# Altium schematic sheet DCI_MCU_144.SchDoc
size 420 x 297 mm; Project: NUCLEO-XXXXZX
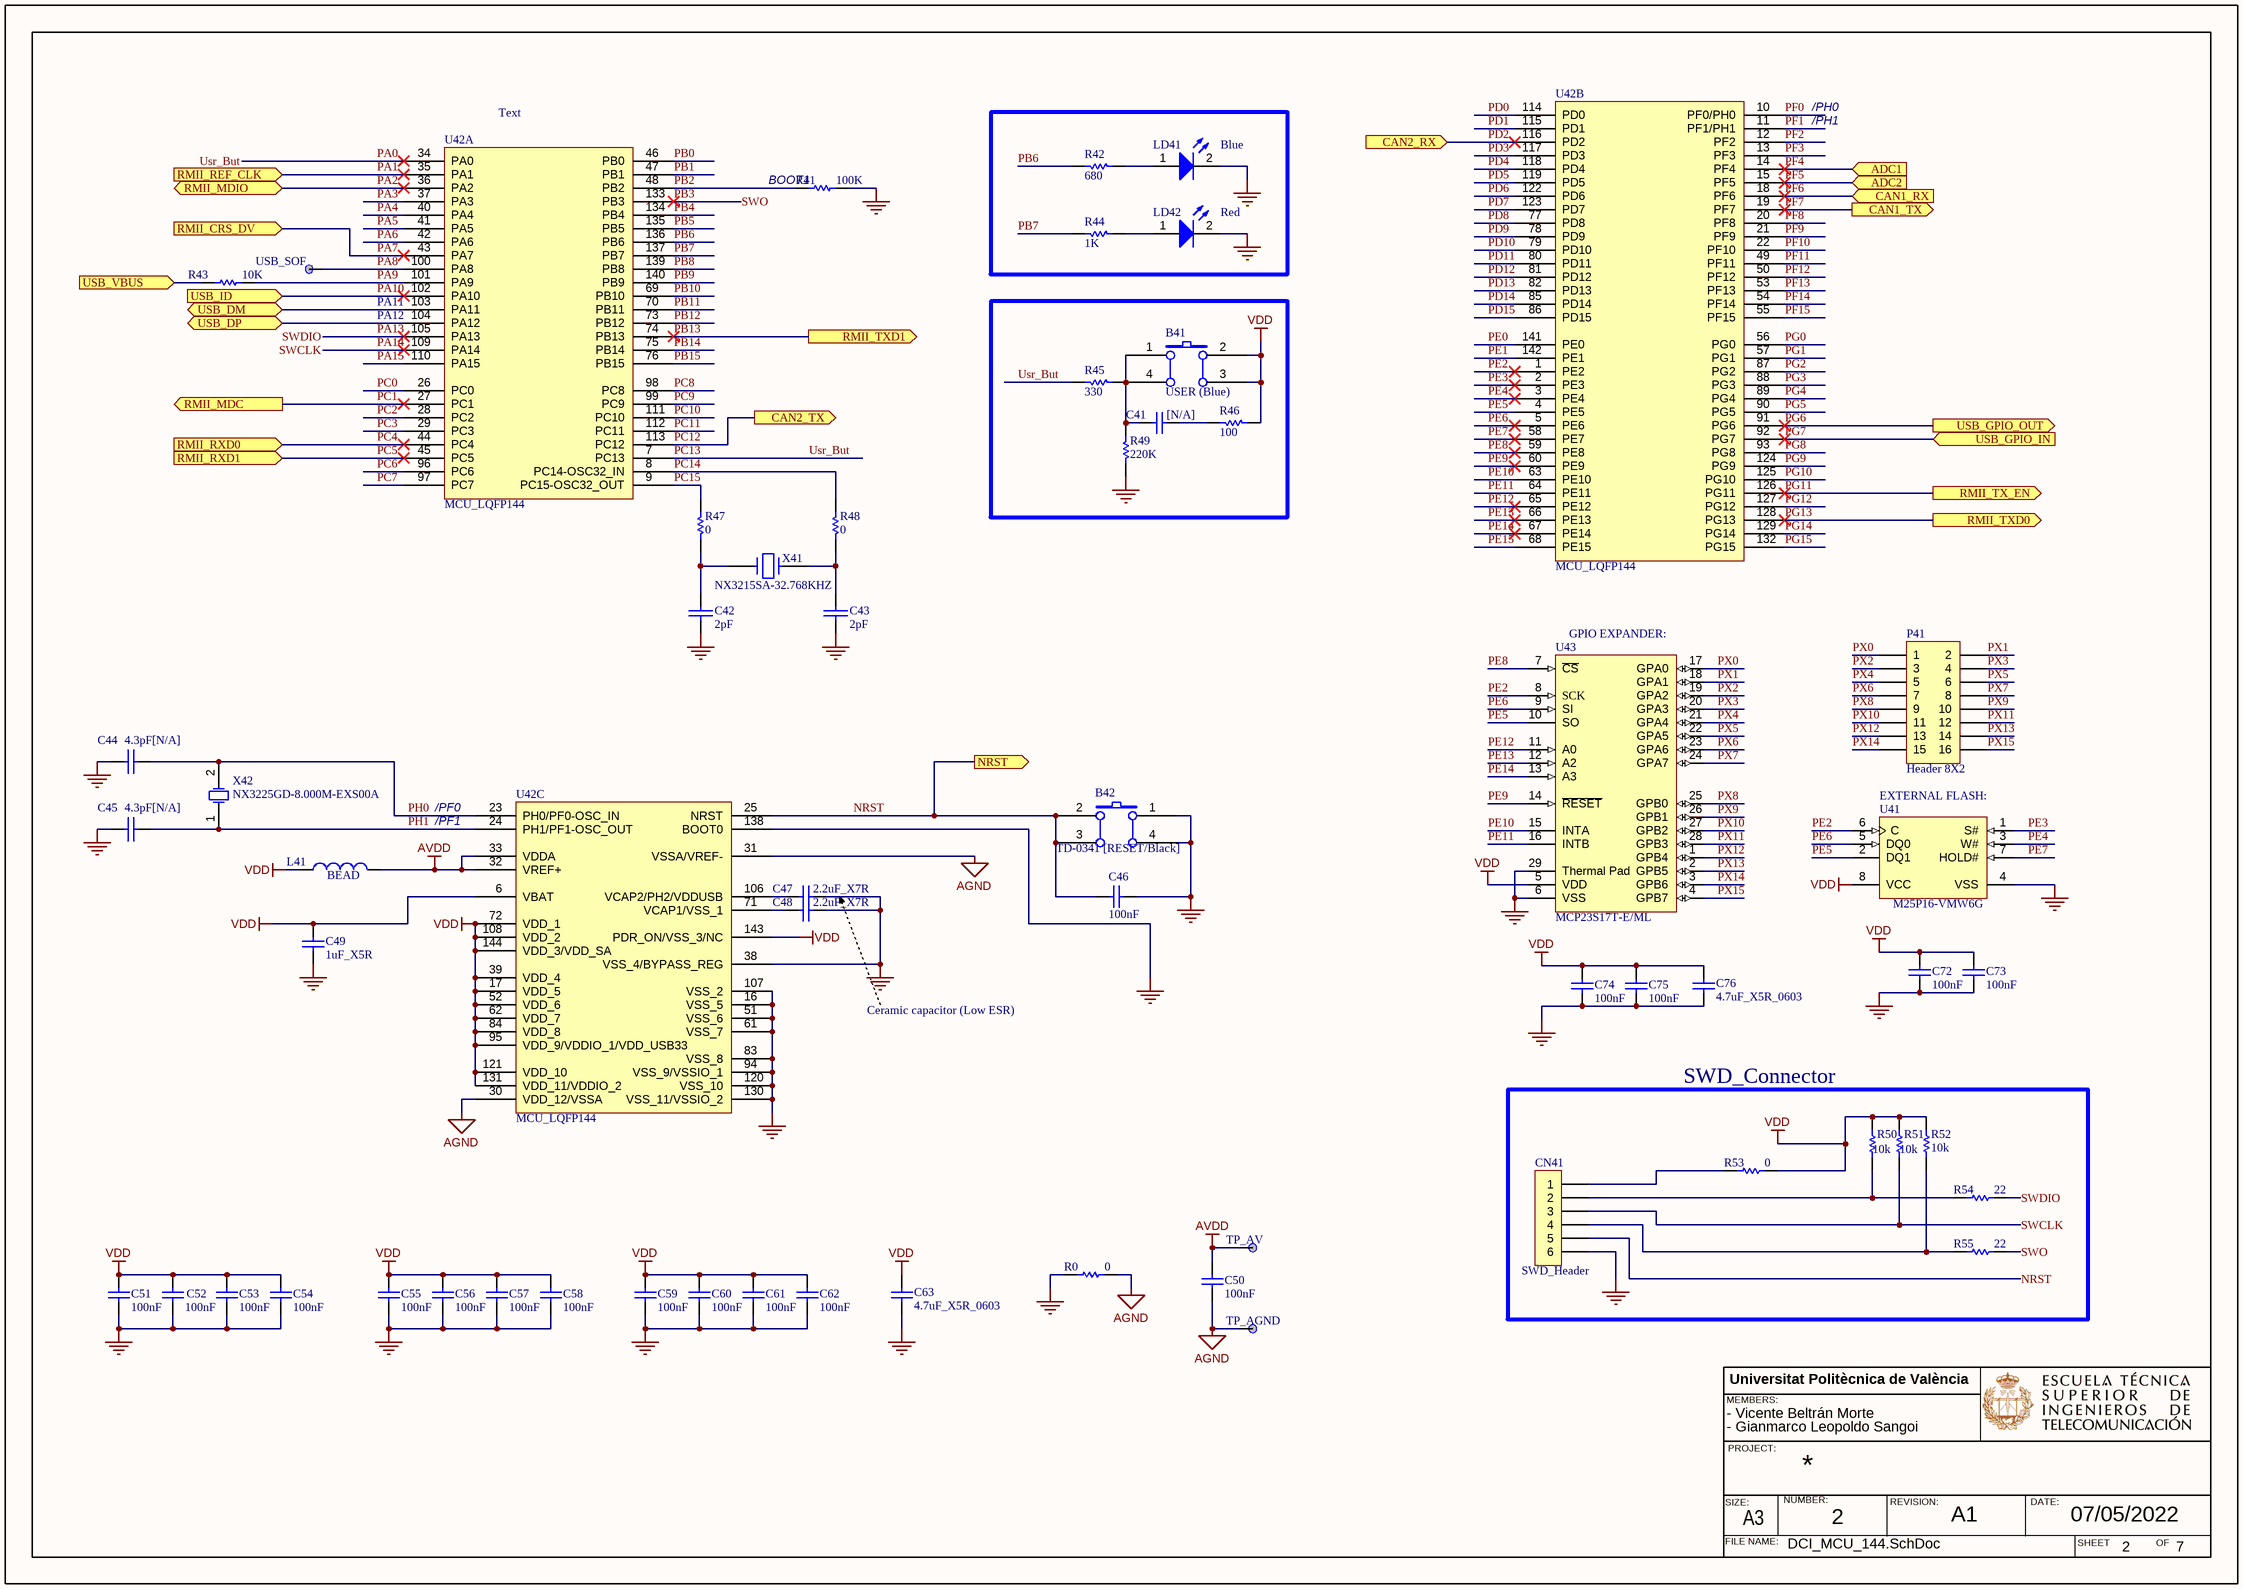
[diagram p0: DCI_MCU_144.SchDoc]

## Parts
B41  USER (Blue)  [PB-6X6mm-Blue]
B42  TD-0341 [RESET/Black]  [PB-6X6mm-Black]
C41  [N/A]  [0603C]
C42  2pF  [0603C]
C43  2pF  [0603C]
C44  4.3pF[N/A]  [0603C]
C45  4.3pF[N/A]  [0603C]
C46  100nF  [0603C]
C47  2.2uF_X7R  [TAN-A - XDown]
C48  2.2uF_X7R  [TAN-A - XUp]
C49  1uF_X5R  [0603C]
C50  100nF  [0603C]
C51  100nF  [0603C]
C52  100nF  [0603C]
C53  100nF  [0603C]
C54  100nF  [0603C]
C55  100nF  [0603C]
C56  100nF  [0603C]
C57  100nF  [0603C]
C58  100nF  [0603C]
C59  100nF  [0603C]
C60  100nF  [0603C]
C61  100nF  [0603C]
C62  100nF  [0603C]
C63  4.7uF_X5R_0603  [0603C]
C72  100nF  [0603C]
C73  100nF  [0603C]
C74  100nF  [0603C]
C75  100nF  [0603C]
C76  4.7uF_X5R_0603  [0603C]
CN41  SWD_Header  [HDR_1x6_2R54_V_M]
L41  BEAD  [0603L]
LD41  Blue  [0603D-B]
LD42  Red  [0603D-R]
P41  Header 8X2  [HDR2X8]
R0  0  [0603R]
R41  100K  [0603R]
R42  680  [0603R]
R43  10K  [0603R]
R44  1K  [0603R]
R45  330  [0603R]
R46  100  [0603R]
R47  0  [0603R]
R48  0  [0603R]
R49  220K  [0603R]
R50  10k  [0603R]
R51  10k  [0603R]
R52  10k  [0603R]
R53  0  [0603R]
R54  22  [0603R]
R55  22  [0603R]
TP_AGND  TP_AGND  [TP]  (value not drawn)
TP_AV  TP_AVDD  [TP]  (value not drawn)
U41  M25P16-VMW6G  [MICT-MW-8_N]
U42  MCU_LQFP144  [TSQFP50P2200X2200X160-144N]  (parts A,B,C of 3)
U43  MCP23S17T-E/ML  [QFN-ML28_L-Improved_Holes]
USB_SOF  USB_SOF  [TP]  (value not drawn)
X41  NX3215SA-32.768KHZ  [XTAL_2SM_3R2X1R5]
X42  NX3225GD-8.000M-EXS00A  [OSC_2SM_3R2x2R5]

## Blocks framed on the sheet
SWD_Connector: CN41 R50-R55

## Ports
ADC1 (in), ADC2 (in), CAN1_RX (in), CAN1_TX (out), CAN2_RX (in), CAN2_TX (out), NRST (out), RMII_CRS_DV (in), RMII_MDC (out), RMII_MDIO (bidir), RMII_REF_CLK (in), RMII_RXD0 (in), RMII_RXD1 (in), RMII_TX_EN (out), RMII_TXD0 (out), RMII_TXD1 (out), USB_DM (bidir), USB_DP (bidir), USB_GPIO_IN (in), USB_GPIO_OUT (out), USB_ID (in), USB_VBUS (in)

## Nets
AGND: C50.2 R0.2 TP_AGND.1 U42.30(VDD_12/VSSA) U42.31(VSSA/VREF-)
AVDD: C50.1 L41.2 TP_AV.1 U42.32(VREF+) U42.33(VDDA)
GND: B42.1(A0) B42.4(A1) C42.2 C43.2 C44.2 C45.2 C46.1 C47.2 C48.2 C49.2 C51.2 C52.2 C53.2 C54.2 C55.2 C56.2 C57.2 C58.2 C59.2 C60.2 C61.2 C62.2 C63.2 C72.2 C73.2 C74.2 C75.2 C76.2 CN41.6 LD41.2(K) LD42.2(K) R0.1 R41.2 R49.2 U41.4(VSS) U42.16(VSS_5) U42.38(VSS_4/BYPASS_REG) U42.51(VSS_6) U42.61(VSS_7) U42.83(VSS_8) U42.94(VSS_9/VSSIO_1) U42.107(VSS_2) U42.120(VSS_10) U42.130(VSS_11/VSSIO_2) U42.138(BOOT0) U43.6(VSS) U43.29(Thermal_Pad)
VDD: B41.2(B0) B41.3(B1) C49.1 C51.1 C52.1 C53.1 C54.1 C55.1 C56.1 C57.1 C58.1 C59.1 C60.1 C61.1 C62.1 C63.1 C72.1 C73.1 C74.1 C75.1 C76.1 L41.1 R46.1 R50.2 R51.2 R52.2 R53.1 U41.8(VCC) U42.6(VBAT) U42.17(VDD_5) U42.39(VDD_4) U42.52(VDD_6) U42.62(VDD_7) U42.72(VDD_1) U42.84(VDD_8) U42.95(VDD_9/VDDIO_1/VDD_USB33) U42.108(VDD_2) U42.121(VDD_10) U42.131(VDD_11/VDDIO_2) U42.143(PDR_ON/VSS_3/NC) U42.144(VDD_3/VDD_SA) U43.5(VDD)
NRST: B42.2(B0) B42.3(B1) C46.2 CN41.5 U42.25(NRST) ; port NRST
PA0: R45.2 U42.7(PC13) U42.34(PA0)  [also labelled PC13, Usr_But]
PA1: U42.35(PA1) ; port RMII_REF_CLK
PA2: U42.36(PA2) ; port RMII_MDIO
PA3: U42.37(PA3)
PA4: U42.40(PA4)
PA5: U42.41(PA5)
PA6: U42.42(PA6)
PA7: U42.43(PA7) ; port RMII_CRS_DV
PA8: U42.100(PA8) USB_SOF.1
PA9: R43.2 U42.101(PA9)
PA10: U42.102(PA10) ; port USB_ID
PA13: R54.2 U42.105(PA13)  [also labelled SWDIO]
PA14: CN41.3 R51.1 U42.109(PA14)  [also labelled SWCLK]
PA15: U42.110(PA15)
PB0: U42.46(PB0)
PB1: U42.47(PB1)
PB2: R41.1 U42.48(PB2)
PB3: R55.2 U42.133(PB3)  [also labelled SWO]
PB4: U42.134(PB4)
PB5: U42.135(PB5)
PB6: R42.1 U42.136(PB6)
PB7: R44.1 U42.137(PB7)
PB8: U42.139(PB8)
PB9: U42.140(PB9)
PB10: U42.69(PB10)
PB11: U42.70(PB11)
PB12: U42.73(PB12)
PB13: U42.74(PB13) ; port RMII_TXD1
PB14: U42.75(PB14)
PB15: U42.76(PB15)
PC0: U42.26(PC0)
PC1: U42.27(PC1) ; port RMII_MDC
PC2: U42.28(PC2)
PC3: U42.29(PC3)
PC4: U42.44(PC4) ; port RMII_RXD0
PC5: U42.45(PC5) ; port RMII_RXD1
PC6: U42.96(PC6)
PC7: U42.97(PC7)
PC8: U42.98(PC8)
PC9: U42.99(PC9)
PC10: U42.111(PC10)
PC11: U42.112(PC11)
PC12: U42.113(PC12) ; port CAN2_TX
PC14: R48.2 U42.8(PC14-OSC32_IN)
PC15: R47.2 U42.9(PC15-OSC32_OUT)
PD0: U42.114(PD0)
PD1: U42.115(PD1)
PD2: U42.116(PD2) ; port CAN2_RX
PD3: U42.117(PD3)
PD4: U42.118(PD4)
PD5: U42.119(PD5)
PD6: U42.122(PD6)
PD7: U42.123(PD7)
PD8: U42.77(PD8)
PD9: U42.78(PD9)
PD10: U42.79(PD10)
PD11: U42.80(PD11)
PD12: U42.81(PD12)
PD13: U42.82(PD13)
PD14: U42.85(PD14)
PD15: U42.86(PD15)
PE0: U42.141(PE0)
PE1: U42.142(PE1)
PE2: U41.6(C) U42.1(PE2) U43.8(SCK)
PE3: U41.1(S#) U42.2(PE3)
PE4: U41.3(W#) U42.3(PE4)
PE5: U41.2(DQ1) U42.4(PE5) U43.10(SO)
PE6: U41.5(DQ0) U42.5(PE6) U43.9(SI)
PE7: U41.7(HOLD#) U42.58(PE7)
PE8: U42.59(PE8) U43.7(~{CS})
PE9: U42.60(PE9) U43.14(~{RESET})
PE10: U42.63(PE10) U43.15(INTA)
PE11: U42.64(PE11) U43.16(INTB)
PE12: U42.65(PE12) U43.11(A0)
PE13: U42.66(PE13) U43.12(A2)
PE14: U42.67(PE14) U43.13(A3)
PE15: U42.68(PE15)
PF0: U42.10(PF0/PH0)
PF1: U42.11(PF1/PH1)
PF2: U42.12(PF2)
PF3: U42.13(PF3)
PF4: U42.14(PF4) ; port ADC1
PF5: U42.15(PF5) ; port ADC2
PF6: U42.18(PF6) ; port CAN1_RX
PF7: U42.19(PF7) ; port CAN1_TX
PF8: U42.20(PF8)
PF9: U42.21(PF9)
PF10: U42.22(PF10)
PF11: U42.49(PF11)
PF12: U42.50(PF12)
PF13: U42.53(PF13)
PF14: U42.54(PF14)
PF15: U42.55(PF15)
PG0: U42.56(PG0)
PG1: U42.57(PG1)
PG2: U42.87(PG2)
PG3: U42.88(PG3)
PG4: U42.89(PG4)
PG5: U42.90(PG5)
PG6: U42.91(PG6) ; port USB_GPIO_OUT
PG7: U42.92(PG7) ; port USB_GPIO_IN
PG8: U42.93(PG8)
PG9: U42.124(PG9)
PG10: U42.125(PG10)
PG11: U42.126(PG11) ; port RMII_TX_EN
PG12: U42.127(PG12)
PG13: U42.128(PG13) ; port RMII_TXD0
PG14: U42.129(PG14)
PG15: U42.132(PG15)
PH0: C44.1 U42.23(PH0/PF0-OSC_IN) X42.2(OSC2)
PH1: C45.1 U42.24(PH1/PF1-OSC_OUT) X42.1(OSC1)
PX0: P41.1 U43.17(GPA0)
PX1: P41.2 U43.18(GPA1)
PX2: P41.3 U43.19(GPA2)
PX3: P41.4 U43.20(GPA3)
PX4: P41.5 U43.21(GPA4)
PX5: P41.6 U43.22(GPA5)
PX6: P41.7 U43.23(GPA6)
PX7: P41.8 U43.24(GPA7)
PX8: P41.9 U43.25(GPB0)
PX9: P41.10 U43.26(GPB1)
PX10: P41.11 U43.27(GPB2)
PX11: P41.12 U43.28(GPB3)
PX12: P41.13 U43.1(GPB4)
PX13: P41.14 U43.2(GPB5)
PX14: P41.15 U43.3(GPB6)
PX15: P41.16 U43.4(GPB7)
USB_DM: U42.103(PA11) ; port USB_DM
USB_DP: U42.104(PA12) ; port USB_DP
USB_VBUS: R43.1 ; port USB_VBUS
NetB41_1: B41.1(A0) B41.4(A1) C41.2 R45.1 R49.1
NetC41_1: C41.1 R46.2
NetC42_1: C42.1 R47.1 X41.1
NetC43_1: C43.1 R48.1 X41.2
NetC47_1: C47.1 U42.106(VCAP2/PH2/VDDUSB)
NetC48_1: C48.1 U42.71(VCAP1/VSS_1)
NetCN41_1: CN41.1 R53.2
NetCN41_2: CN41.2 R50.1 R54.1
NetCN41_4: CN41.4 R52.1 R55.1
NetLD41_1: LD41.1(A) R42.2
NetLD42_1: LD42.1(A) R44.2

## Notes on the sheet
- (near U42) Text
- /PH0
- /PH1
- (near R41) BOOT1
- (near U42) PA11
- (near U42) PA12
- (near U43) GPIO EXPANDER:
- EXTERNAL FLASH:
- /PF0
- /PF1
- Ceramic capacitor (Low ESR)
- MEMBERS:
- Universitat Politècnica de València
- - Gianmarco Leopoldo Sangoi
- - Vicente Beltrán Morte
- PROJECT:
- SIZE:
- FILE NAME:
- A3
- NUMBER:
- 2
- REVISION:
- A1
- DATE:
- 07/05/2022
- SHEET
- OF
- 7

## Library data of the parts
B41 B42 = SW PUSHBUTTON: SE PUSHBUTTON
C41 C46 = CAP: Capacitor; Value: 100pF; Published: 8-Jun-2000; Revision: July-2002: Re-released for DXP Platform.; Publisher: Altium Limited
C42-C45 = CAP: Capacitor
C47 C48 = Cap_2.2uF_X7R_10%_0805: Capacitor,2.2uF,16V, X7R,10%,0805,YAGEO; Manuf_Part_1: CC0805KKX7R7BB225; Revision: July-2002: Re-released for DXP Platform.; Value: 2.2uF; Order: CC0805KKX7R7BB225; Manuf_1: YAGEO
C49 = CAP SMD 0603  X5R 1µF 25V 10%: 0603  X5R 1µF; Rated voltage: 25V; Tolerance: 10%; Manufacturer: *; Manufacturer P/N: *; Order code Farnell: 1288202RL; Value: 1µF; Power: *; Technology: X5R; Temperature  Factor: *; Temperature Max: +125°C; Temperature Min: -55°C; STS Code: *
C50-C62 C72-C75 = Cap: Capacitor; Value: 10nF; Published: 8-Jun-2000; Revision: July-2002: Re-released for DXP Platform.; Publisher: Altium Limited
C63 C76 = CAP SMD 0603  X5R 1µF 25V 10%: 0603  X5R 4.7uF; Value: 1µF; Rated voltage: 25V; Tolerance: 10%; Manufacturer: *; Manufacturer P/N: *; Order code Farnell: 1288202RL; Power: *; Technology: X5R; Temperature  Factor: *; Temperature Max: +125°C; Temperature Min: -55°C; STS Code: *
CN41 = Header 6X1: Header, 6-Pin, Single row; LatestRevisionDate: 17-Jul-2002; LatestRevisionNote: Re-released for DXP Platform.; Publisher: Altium Limited
L41 = Inductor: Value: 100uH; Published: 8-Jun-2000; Revision: July-2002: Re-released for DXP Platform.; Publisher: Altium Limited
LD41 LD42 = LED2: Typical RED, GREEN, YELLOW, AMBER GaAs LED; Published: 8-Jun-2000; Revision: July-2002: Re-released for DXP Platform.; Publisher: Altium Limited
P41 = Header 8X2: Header, 8-Pin, Dual row; LatestRevisionDate: 17-Jul-2002; LatestRevisionNote: Re-released for DXP Platform.; Publisher: Altium Limited
R0 R41 R49 = res1: Resistor; Value: 1K; Published: 8-Jun-2000; Revision: July-2002: Re-released for DXP Platform.; Publisher: Altium Limited
R42 R45-R48 = Res1: Resistor; Value: 1K; Published: 8-Jun-2000; Revision: July-2002: Re-released for DXP Platform.; Publisher: Altium Limited
R43 R50-R52 = Resistor_ST: Resistor 0402 / 0603 / 0805; Value: 10K
R44 = Res1: Resistor; Published: 8-Jun-2000; Revision: July-2002: Re-released for DXP Platform.; Publisher: Altium Limited; Value: 1K
R53-R55 = Resistor_ST: Resistor 0402 / 0603 / 0805; Value: 10K
TP_AGND TP_AV USB_SOF = TP
U41 = CMP-0357-00145-1: 16 Mb (x1) Serial NOR Flash Memory, 75 MHz, 2.7 to 3.6 V, 8-pin SO8 Wide (MW), Tube; Manufacturer: Micron; Part Family: M25PÂ; Density: 16MbÂ; Speed: 75 MHzÂ; Voltage: 2.7V-3.6VÂ; Mounting Technology: Surface Mount; PackageVersion: Rev 8; DatasheetVersion: Rev. Y; Type: Data StorageÂ; ComponentLink1URL: http://www.micron.com/; ComponentLink1Description: Manufacturer URL; PartNumber: M25P16-VMW6G; ComponentLink3Description: Package Specification; PackageReference: MICT-MW-8; PackageDescription: 8-Pin SO Wide, 5.62 X 6.05 mm, Pitch 1.27 mm; ComponentLink3URL: http://www.micron.com/~/media/Documents/Products/Data%20Sheet/NOR%20Flash/Serial%20NOR/M25P/M25P16.pdf; ComponentLink2URL: http://www.micron.com/~/media/Documents/Products/Data%20Sheet/NOR%20Flash/Serial%20NOR/M25P/M25P16.pdf; Part Status: ProductionÂ; RoHS: YesÂ; ComponentLink2Description: Datasheet; Applications: EmbeddedÂ; Package: SO8 WideÂ; Width: x1Â
U43 = MCP23S17T-E/ML: 16 output GPIO expander
X41 = CRYSTAL_32K: Crystal
X42 = XTAL: Crystal Oscillator; Published: 8-Jun-2000; LatestRevisionDate: 17-Jul-2002; LatestRevisionNote: Re-released for DXP Platform.; PackageReference: R38; Publisher: Altium Limited